# Altium project 21-0001-01 TZEXs II.PrjPcb
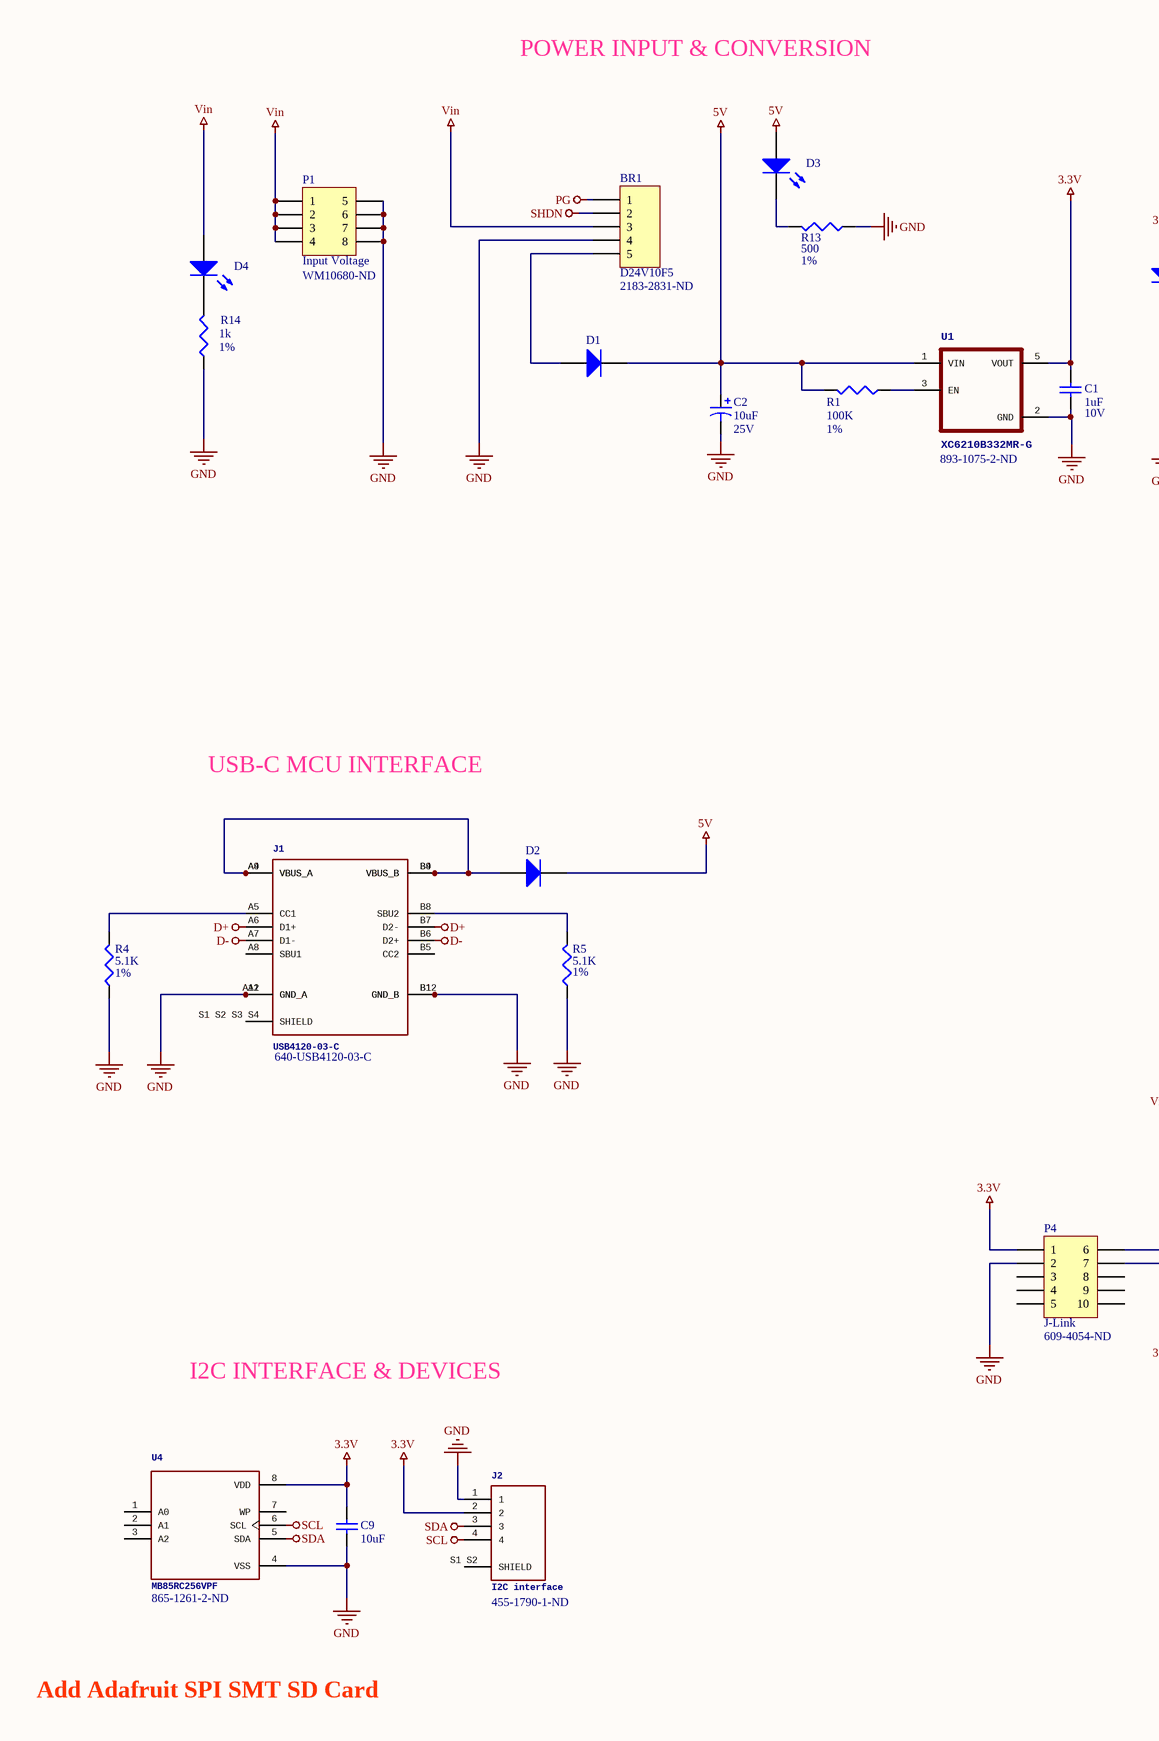
[diagram p0: Sheet1.SchDoc, left]
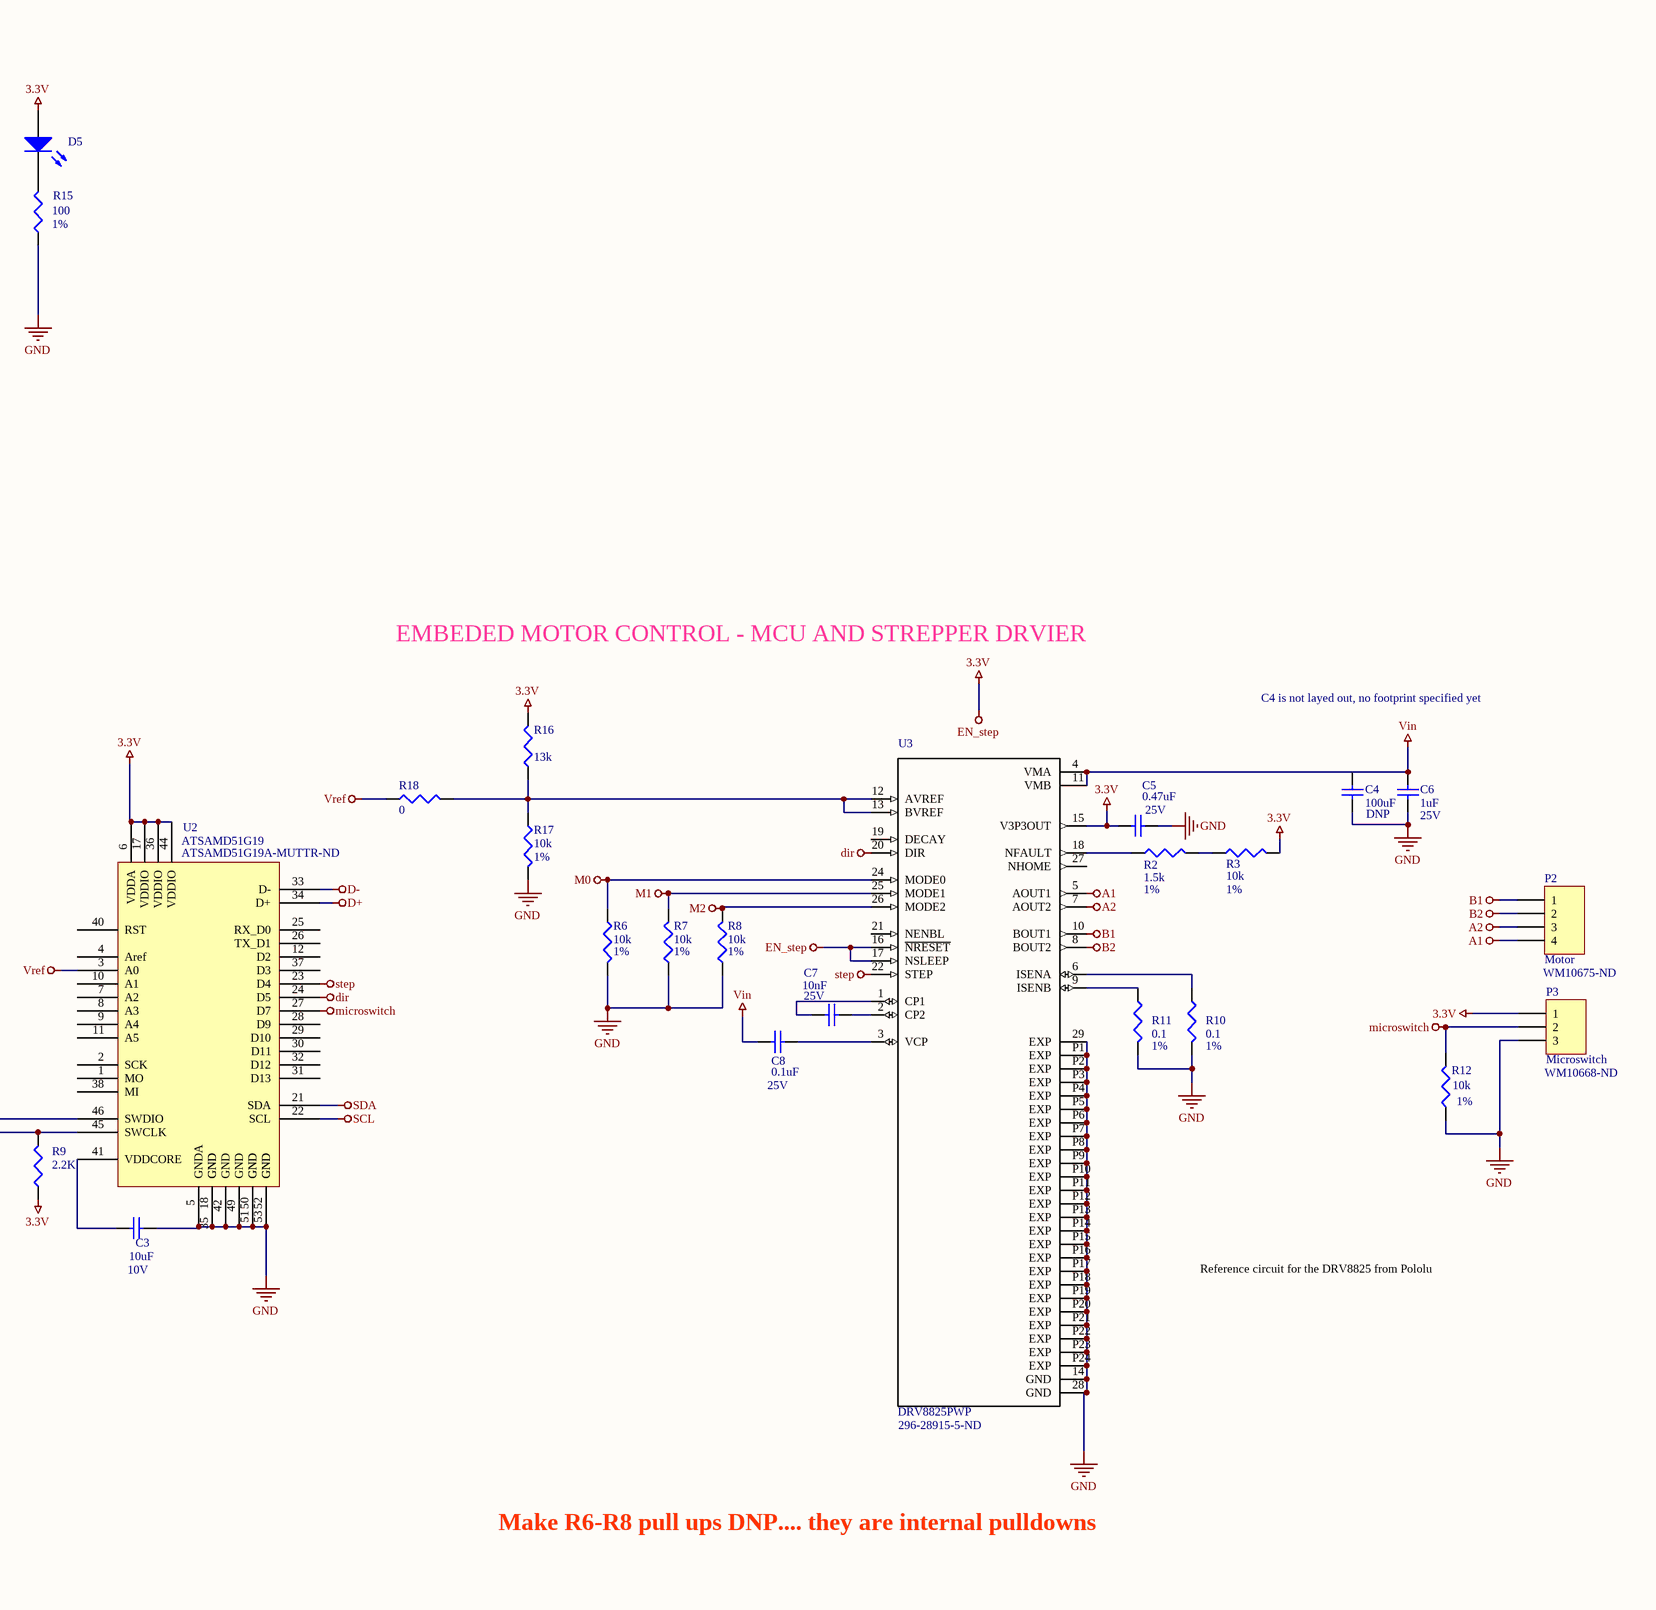
[diagram p1: Sheet1.SchDoc, right]
1 sheet, 43 parts. Net scope: global (net labels, ports and power ports of the same name join across sheets).

## Sheet Sheet1.SchDoc
size A2

### Parts
BR1  D24V10F5  Digi-Key Part Number: 2183-2831-ND  [HDR1X5]
C1  value 1uF  Voltage Rating: 10V  [1608[0603]]  (hidden comment: Cap Semi)
C2  value 10uF  Voltage Rating: 25V  [C1206]  (hidden comment: Cap Pol3)
C3  value 10uF  Voltage Rating: 10V  [1608[0603]]  (hidden comment: Cap Semi)
C4  DNP  value 100uF  [*CAPPC7343X430N]
C5  value 0.47uF  Voltage Rating: 25V  [1608[0603]]  (hidden comment: Cap Semi)
C6  value 1uF  Voltage Rating: 25V  [1608[0603]]  (hidden comment: Cap Semi)
C7  value 10nF  Voltage Rating: 25V  [0402]  (hidden comment: Cap Semi)
C8  value 0.1uF  Voltage Rating: 25V  [0402]  (hidden comment: Cap Semi)
C9  value 10uF  [1608[0603]]  (hidden comment: Cap Semi)
D1  Diode  [SODFL3514X100N]  (value not drawn)
D2  Diode  [SODFL3514X100N]  (value not drawn)
D3  LED3  [1608[0603]]  (value not drawn)
D4  LED3  [1608[0603]]  (value not drawn)
D5  LED3  [1608[0603]]  (value not drawn)
J1  USB4120-03-C  Mouser Part Number: 640-USB4120-03-C  [GCT_USB4120-03-C_REVA]
J2  I2C interface  Digi-Key_Part_Number: 455-1790-1-ND  [CONN_BM04B-SRSS-TB(LF)(SN)]
P1  Input Voltage  Digi-Key Part Number: WM10680-ND  [2X4 VERTICAL]
P2  Motor  Digi-Key Part Number: WM10675-ND  [1x4 Vertical]
P3  Microswitch  Digi-Key Part Number: WM10668-ND  [1x3 VERTICAL]
P4  J-Link  Digi-Key Part Number: 609-4054-ND  [J-Link]
R1  value 100K  Tolerance: 1%  [J1-0603]  (hidden comment: Res3)
R2  value 1.5k  Tolerance: 1%  [0402]  (hidden comment: Res3)
R3  value 10k  Tolerance: 1%  [0402]  (hidden comment: Res3)
R4  value 5.1K  Tolerance: 1%  [J1-0603]  (hidden comment: Res3)
R5  value 5.1K  Tolerance: 1%  [J1-0603]  (hidden comment: Res3)
R6  value 10k  Tolerance: 1%  [0402]  (hidden comment: Res3)
R7  value 10k  Tolerance: 1%  [0402]  (hidden comment: Res3)
R8  value 10k  Tolerance: 1%  [0402]  (hidden comment: Res3)
R9  value 2.2K  [J1-0603]  (hidden comment: Res3)
R10  value 0.1  Tolerance: 1%  [14-1210]  (hidden comment: Res3)
R11  value 0.1  Tolerance: 1%  [14-1210]  (hidden comment: Res3)
R12  value 10k  Tolerance: 1%  [J1-0603]  (hidden comment: Res3)
R13  value 500  Tolerance: 1%  [J1-0603]  (hidden comment: Res3)
R14  value 1k  Tolerance: 1%  [J1-0603]  (hidden comment: Res3)
R15  value 100  Tolerance: 1%  [J1-0603]  (hidden comment: Res3)
R16  value 13k  [J1-0603]  (hidden comment: Res3)
R17  value 10k  Tolerance: 1%  [J1-0603]  (hidden comment: Res3)
R18  value 0  [J1-0603]  (hidden comment: Res3)
U1  XC6210B332MR-G  Digi-Key Part Number: 893-1075-2-ND  [SOT95P285X140-5N]
U2  ATSAMD51G19  Digi-Key Part Number: ATSAMD51G19A-MUTTR-ND  [QFN50P700X700X90-49N]
U3  DRV8825PWP  Digi-Key Part Number: 296-28915-5-ND  [*SOP65P640X120-29N_DRV8825PWP(Primary)]
U4  MB85RC256VPF  Digi-Key Part Number: 865-1261-2-ND  [SOP127P797X210-8N]

### Nets
3.3V: C1.2 C5.1 C9.2 D5.1(A) J2.2 P3.1 P4.1 R3.2 R9.1 R16.2 U1.5(VOUT) U2.6(VDDA) U2.17(VDDIO) U2.36(VDDIO) U2.44(VDDIO) U3.15(V3P3OUT) U3.16(~{NRESET}) U3.17(NSLEEP) U4.8(VDD)  [also labelled EN_step]
5V: C2.1 D1.2(K) D2.2(K) D3.1(A) R1.2 U1.1(VIN)
A1: P2.4 U3.5(AOUT1)
A2: P2.3 U3.7(AOUT2)
B1: P2.1 U3.10(BOUT1)
B2: P2.2 U3.8(BOUT2)
D+: J1.A6(D1+) J1.B7(D2-) U2.34(D+)
D-: J1.A7(D1-) J1.B6(D2+) U2.33(D-)
dir: U2.24(D5) U3.20(DIR)
GND: BR1.4 C1.1 C2.2 C3.2 C4.2 C5.2 C6.2 C9.1 J1.A1(GND_A) J1.A12(GND_A) J1.B1(GND_B) J1.B12(GND_B) J2.1 P1.5 P1.6 P1.7 P1.8 P3.3 P4.2 R4.1 R5.1 R6.2 R7.1 R8.1 R10.2 R11.2 R12.1 R13.1 R14.1 R15.1 R17.2 U1.2(GND) U2.5(GNDA) U2.18(GND) U2.35(GND) U2.42(GND) U2.49(GND) U2.50(GND) U2.51(GND) U2.52(GND) U2.53(GND) U3.14(GND) U3.28(GND) U3.29(EXP) U3.P1(EXP) U3.P2(EXP) U3.P3(EXP) U3.P4(EXP) U3.P5(EXP) U3.P6(EXP) U3.P7(EXP) U3.P8(EXP) U3.P9(EXP) U3.P10(EXP) U3.P11(EXP) U3.P12(EXP) U3.P13(EXP) U3.P14(EXP) U3.P15(EXP) U3.P16(EXP) U3.P17(EXP) U3.P18(EXP) U3.P19(EXP) U3.P20(EXP) U3.P21(EXP) U3.P22(EXP) U3.P23(EXP) U3.P24(EXP) U4.4(VSS)
M0: R6.1 U3.24(MODE0)
M1: R7.2 U3.25(MODE1)
M2: R8.2 U3.26(MODE2)
microswitch: P3.2 R12.2 U2.27(D7)
PG: BR1.1
SCL: J2.4 U2.22(SCL) U4.6(SCL)
SDA: J2.3 U2.21(SDA) U4.5(SDA)
SHDN: BR1.2
step: U2.23(D4) U3.22(STEP)
Vin: BR1.3 C4.1 C6.1 C8.1 D4.1(A) P1.1 P1.2 P1.3 P1.4 U3.4(VMA) U3.11(VMB)
Vref: R18.1 U2.3(A0)
NetBR1_5: BR1.5 D1.1(A)
NetC3_1: C3.1 U2.41(VDDCORE)
NetC7_1: C7.1 U3.1(CP1)
NetC7_2: C7.2 U3.2(CP2)
NetC8_2: C8.2 U3.3(VCP)
NetD2_1: D2.1(A) J1.A4(VBUS_A) J1.A9(VBUS_A) J1.B4(VBUS_B) J1.B9(VBUS_B)
NetD3_2: D3.2(K) R13.2
NetD4_2: D4.2(K) R14.2
NetD5_2: D5.2(K) R15.2
NetJ1_A5: J1.A5(CC1) R4.2
NetJ1_B8: J1.B8(SBU2) R5.2
NetP4_6: P4.6 U2.46(SWDIO)
NetP4_7: P4.7 R9.2 U2.45(SWCLK)
NetR1_1: R1.1 U1.3(EN)
NetR2_1: R2.1 U3.18(NFAULT)
NetR2_2: R2.2 R3.1
NetR10_1: R10.1 U3.6(ISENA)
NetR11_1: R11.1 U3.9(ISENB)
NetR16_1: R16.1 R17.1 R18.2 U3.12(AVREF) U3.13(BVREF)

Not connected (* = marked no-connect by the designer): J1 A8(SBU1) B5(CC2) S1 S2 S3 S4(SHIELD); J2 S1 S2(SHIELD); P4 3 4 5 8 9 10; U2 1(MO) 2(SCK) 4(Aref) 7(A2) 8(A3) 9(A4) 10(A1) 11(A5) 12(D2) 25(RX_D0) 26(TX_D1) 28(D9) 29(D10) 30(D11) 31(D13) 32(D12) 37(D3) 38(MI) 40(RST); U3 19(DECAY) 21(NENBL) 27(NHOME); U4 1(A0) 2(A1) 3(A2) 7(WP)

### Notes on the sheet
- POWER INPUT & CONVERSION
- USB-C MCU INTERFACE
- EMBEDED MOTOR CONTROL - MCU AND STREPPER DRVIER
- C4 is not layed out, no footprint specified yet
- I2C INTERFACE & DEVICES
- Reference circuit for the DRV8825 from Pololu
- Add Adafruit SPI SMT SD Card
- Make R6-R8 pull ups DNP.... they are internal pulldowns
- Title:
- Group:
- Number:
- Date:
- Path:
- Time:
- Revision:
- Sheet
- of
- Project:
- Engineer:

### Library data of the parts
BR1 = Header 5: Header, 5-Pin; Manufacturer: Pololu Corporation; Single Unit Price: 7.49; Manufacturer Product Number: D24V10F5
C1 C3-C9 = Cap Semi: Capacitor (Semiconductor SIM Model); Published: 8-Jun-2000; LatestRevisionDate: 29-May-2009; LatestRevisionNote: IPC-7351 Footprint Added.; PackageReference: C1206; Publisher: Altium Limited; PackageDescription: Chip Capacitor
C2 = Cap Pol3: Polarized Capacitor (Surface Mount); Published: 8-Jun-2000; LatestRevisionDate: 29-May-2009; LatestRevisionNote: IPC-7351 Footprint Added.; PackageReference: C0805; Publisher: Altium Limited; PackageDescription: Chip Capacitor
D1 D2 = Diode: Default Diode; Published: 8-Jun-2000; LatestRevisionDate: 17-Jul-2002; LatestRevisionNote: Re-released for DXP Platform.; PackageVersion: Sep-1996; PackageReference: SMC; Publisher: Altium Limited; PackageDescription: DO-214-AB/SMC; 2 C-Bend Leads; Body 7.9 x 5.9 mm, inc. leads (LxW); Code_JEDEC: DO-214-AB
D3-D5 = LED3: Typical BLUE SiC LED; Published: 8-Jun-2000; LatestRevisionDate: 17-Dec-2003; LatestRevisionNote: PCB Footprint replaced.; DatasheetVersion: 16-Apr-2002; PackageVersion: 16-Apr-2002; PackageReference: 3.5X2.8X1.9; Publisher: Altium Limited; PackageDescription: SM LED; 2 C-Bend Leads; Body 3.5 x 2.8 x 1.9 mm, inc leads (LxWxH typ)
J1 = USB4120-03-C_REVA: Manufacturer: Global Connector Technology; Single Unit Price: 0.92; Manufacturer Product Number: USB4120-03-C
J2 = BM04B-SRSS-TB(LF)(SN): GateName_1: G$1; MF: JST Sales; SymbolName_1: BM04B-SRSS-TB(LF)(SN); LibraryName: BM04B-SRSS-TB_LF__SN; DeviceSetName: BM04B-SRSS-TB(LF)(SN); Package: None; MP: BM04B-SRSS-TB(LF)(SN); DigiKey-Purchase-URL: https://snapeda.com/shop?store=DigiKey&id=91778
P1 = Header 4X2A: Header, 4-Pin, Dual row; Manufacturer: Molex; Manufacturer Product Number: 0430450824; Single Unit Price: 2.10
P2 = Header 4: Header, 4-Pin; Manufacturer: Molex; Manufacturer Product Number: 0436500429; Single Unit Price: 1.95
P3 = Header 3: CONN HEADER VERT 3POS 3MM; Manufacturer: Molex; Manufacturer Product Number: 0436500329; Single Unit Price: 1.46
P4 = Header 5X2A: Header, 5-Pin, Dual row
R1-R8 R10-R18 = Res3: Resistor; Published: 8-Jun-2000; LatestRevisionDate: 29-May-2009; LatestRevisionNote: IPC-7351 Footprint Added.; PackageReference: J1-0603; Publisher: Altium Limited; PackageDescription: Chip Resistor
  R1: Digi-Key Part Number: 1135-1060-2-ND
  R2: Mouser: 652-CR0402FX-1501GLF
R9 = Res3: Resistor; Tolerance: 1%; Published: 8-Jun-2000; LatestRevisionDate: 29-May-2009; LatestRevisionNote: IPC-7351 Footprint Added.; PackageReference: J1-0603; Publisher: Altium Limited; PackageDescription: Chip Resistor
U1 = AP2112K-3.3TRG1: Manufacturer: Torex Semiconductor Ltd; Single Unit Price: 0.85; Manufacturer Product Number: XC6210B332MR-G; Supplier Device Package: SOT-25-5
U2 = itsy bitsy m4_1: Manufacturer: Microchip Technology; Manufacturer Product Number: ATSAMD51G19A-MUT; Single Unit Price: 5.39000; Supplier Device Package: 48-QFN
U3 = DRV8825PWP: 2.5A Bipolar Stepper Motor Driver with On-Chip 1/32 Microstepping Indexer _Step/Dir Ctrl_ 28-HTSSOP -40 to 85; Manufacturer: Texas Instruments; Manufacturer Product Number: DRV8825PWP; Supplier Device Package: 28-HTSSOP; Mounting Type: Surface Mount
U4 = MB85RC256VPF-G-JNERE2: Manufacturer: Kaga FEI America, Inc.; Manufacturer Product Number: MB85RC256VPNF-G-JNERE1; Supplier Device Package: 8-SOP; Mounting Type: Surface Mount